# Altium schematic sheet Motor_Drivers.SchDoc
size A3; Author: İlker KESER; Revision: V1.0; SheetNumber: 4; SheetTotal: 9; Page: 4; Page Total: 9; Template: A3; Project Code: 02050838
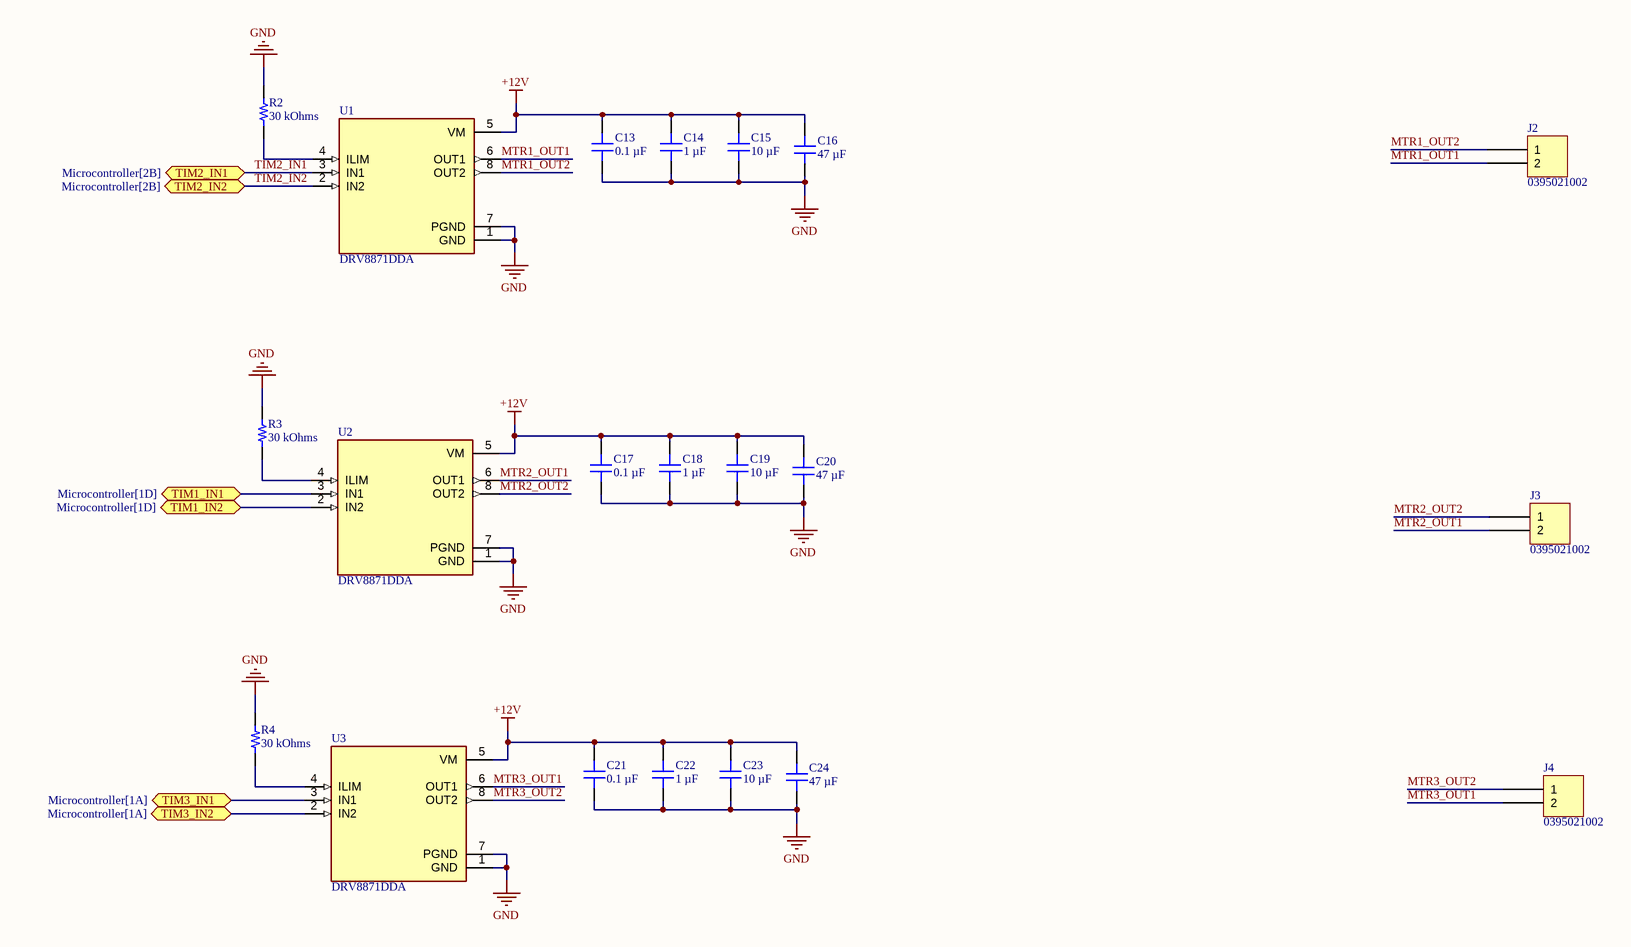
[diagram p0: Motor_Drivers.SchDoc]

## Parts
C13  0.1 µF  [CAP 0603_1608]
C14  1 µF  [MURATA GCM188 0603_1608]
C15  10 µF  [CAP 0603_1608]
C16  47 µF  [MURATA CAP GRM31C 1206_3216]
C17  0.1 µF  [CAP 0603_1608]
C18  1 µF  [MURATA GCM188 0603_1608]
C19  10 µF  [CAP 0603_1608]
C20  47 µF  [MURATA CAP GRM31C 1206_3216]
C21  0.1 µF  [CAP 0603_1608]
C22  1 µF  [MURATA GCM188 0603_1608]
C23  10 µF  [CAP 0603_1608]
C24  47 µF  [MURATA CAP GRM31C 1206_3216]
J2  0395021002  [MOLEX 395021002]
J3  0395021002  [MOLEX 395021002]
J4  0395021002  [MOLEX 395021002]
R2  30 kOhms  [YAGEO RES 0402_1005]
R3  30 kOhms  [YAGEO RES 0402_1005]
R4  30 kOhms  [YAGEO RES 0402_1005]
U1  DRV8871DDA  [DRV8871DDA]
U2  DRV8871DDA  [DRV8871DDA]
U3  DRV8871DDA  [DRV8871DDA]

## Ports
TIM1_IN1 (bidir, see Microcontroller[1D]), TIM1_IN2 (bidir, see Microcontroller[1D]), TIM2_IN1 (bidir, see Microcontroller[2B]), TIM2_IN2 (bidir, see Microcontroller[2B]), TIM3_IN1 (bidir, see Microcontroller[1A]), TIM3_IN2 (bidir, see Microcontroller[1A])

## Nets
+12V: C13.2 C14.2 C15.2 C16.2 C17.2 C18.2 C19.2 C20.2 C21.2 C22.2 C23.2 C24.2 U1.5(VM) U2.5(VM) U3.5(VM)
GND: C13.1 C14.1 C15.1 C16.1 C17.1 C18.1 C19.1 C20.1 C21.1 C22.1 C23.1 C24.1 R2.2 R3.2 R4.2 U1.1(GND) U1.7(PGND) U2.1(GND) U2.7(PGND) U3.1(GND) U3.7(PGND)
MTR1_OUT1: J2.2 U1.6(OUT1)
MTR1_OUT2: J2.1 U1.8(OUT2)
MTR2_OUT1: J3.2 U2.6(OUT1)
MTR2_OUT2: J3.1 U2.8(OUT2)
MTR3_OUT1: J4.2 U3.6(OUT1)
MTR3_OUT2: J4.1 U3.8(OUT2)
TIM1_IN1: U2.3(IN1) ; port TIM1_IN1
TIM1_IN2: U2.2(IN2) ; port TIM1_IN2
TIM2_IN1: U1.3(IN1) ; port TIM2_IN1
TIM2_IN2: U1.2(IN2) ; port TIM2_IN2
TIM3_IN1: U3.3(IN1) ; port TIM3_IN1
TIM3_IN2: U3.2(IN2) ; port TIM3_IN2
NetR2_1: R2.1 U1.4(ILIM)
NetR3_1: R3.1 U2.4(ILIM)
NetR4_1: R4.1 U3.4(ILIM)

## Notes on the sheet
- TITLE:
- DOCUMENT NAME:
- PROJECT CODE:
- TEMPLATE:
- REVISION:
- Sheet:
- of
- AUTHOR:

## Library data of the parts
C13 C17 C21 = C0603X104M3RAC7867: CAP CER 0.1UF 25V X7R 0603; manufacturer: KEMET; Tolerance: ±20%; Part Number: C0603X104M3RAC7867; Capacitance: 0.1 µF; Applications: Boardflex Sensitive; componentlink1description: Datasheet; componentlink1url: https://api.kemet.com/component-edge/download/datasheet/C0603X104M3RACTU.pdf; componentlink2description: DigiKey Link; componentlink2url: https://www.digikey.com/en/products/detail/kemet/C0603X104M3RAC7867/2202613; Device Package: 0603 (1608 Metric); Features: Soft Termination; lastupdated: 9.02.2024 20:10:30; Lifecycle Status: Active; Minimum Order: 1; Mounting Type: Surface Mount, MLCC; Operating Temperature: -55°C ~ 125°C; Package / Case: 0603 (1608 Metric); packaging: TapeAndReel; partid: 2484; Part Status: Active; price: 0.06; series: SMD Comm X7R Flex; Size / Dimension: 0.063" L x 0.031" W (1.60mm x 0.80mm); Supplier 1: DigiKey; Supplier Part Number 1: 399-13148-1-ND; Temperature Coefficient: X7R; Thickness (Max): 0.034" (0.87mm); value: 0.1 µF; Voltage - Rated: 25V
C14 C18 C22 = GCM188R71C105KA64J: CAP CER 1UF 16V X7R 0603; manufacturer: Murata Electronics; Tolerance: ±10%; Part Number: GCM188R71C105KA64J; Capacitance: 1 µF; Applications: Automotive; componentlink1description: Datasheet; componentlink1url: https://www.murata.com/~/media/webrenewal/support/library/catalog/products/capacitor/mlcc/c03e.ashx?la=en-us; componentlink2description: DigiKey Link; componentlink2url: https://www.digikey.com/en/products/detail/murata-electronics/GCM188R71C105KA64J/4903955; Device Package: 0603 (1608 Metric); lastupdated: 20.07.2024 00:25:01; Lifecycle Status: Active; Minimum Order: 1; Mounting Type: Surface Mount, MLCC; Operating Temperature: -55°C ~ 125°C; Package / Case: 0603 (1608 Metric); packaging: TapeAndReel; partid: 13992; Part Status: Active; price: 0.02; Ratings: AEC-Q200; series: GCM; Size / Dimension: 0.063" L x 0.031" W (1.60mm x 0.80mm); Supplier 1: DigiKey; Supplier Part Number 1: 490-12657-1-ND; Temperature Coefficient: X7R; Thickness (Max): 0.035" (0.90mm); value: 1 µF; Voltage - Rated: 16V
C15 C19 C23 = CC0603MRX5R7BB106: CAP CER 10UF 16V X5R 0603; manufacturer: Yageo; Tolerance: ±20%; Part Number: CC0603MRX5R7BB106; Capacitance: 10 µF; Applications: General Purpose; componentlink1description: Datasheet; componentlink1url: https://www.yageo.com/upload/media/product/productsearch/datasheet/mlcc/UPY-GPHC_X5R_4V-to-50V_26.pdf; componentlink2description: DigiKey Link; componentlink2url: https://www.digikey.com/en/products/detail/yageo/CC0603MRX5R7BB106/5195229; Device Package: 0603 (1608 Metric); lastupdated: 9.02.2024 20:09:51; Lifecycle Status: Active; Minimum Order: 1; Mounting Type: Surface Mount, MLCC; Operating Temperature: -55°C ~ 85°C; Package / Case: 0603 (1608 Metric); packaging: TapeAndReel; partid: 41163; Part Status: Active; price: 0.08; series: CC; Size / Dimension: 0.063" L x 0.031" W (1.60mm x 0.80mm); Supplier 1: DigiKey; Supplier Part Number 1: 311-1822-1-ND; Temperature Coefficient: X5R; Thickness (Max): 0.035" (0.90mm); value: 10 µF; Voltage - Rated: 16V
C16 C20 C24 = GRM31CR61E476ME44L: CAP CER 47UF 25V X5R 1206; manufacturer: Murata Electronics; Tolerance: ±20%; Part Number: GRM31CR61E476ME44L; Capacitance: 47 µF; Applications: General Purpose; componentlink2description: DigiKey Link; componentlink2url: https://www.digikey.com/en/products/detail/murata-electronics/GRM31CR61E476ME44L/7243446; Device Package: 1206 (3216 Metric); lastupdated: 6.09.2024 02:27:23; Lifecycle Status: Active; Minimum Order: 1; Mounting Type: Surface Mount, MLCC; Operating Temperature: -55°C ~ 85°C; Package / Case: 1206 (3216 Metric); packaging: CutTape; partid: 54228; Part Status: Active; price: 0.39; series: GRM; Size / Dimension: 0.126" L x 0.063" W (3.20mm x 1.60mm); Supplier 1: DigiKey; Supplier Part Number 1: 490-16268-2-ND; Temperature Coefficient: X5R; Thickness (Max): 0.071" (1.80mm); value: 47 µF; Voltage - Rated: 25V
J2-J4 = 0395021002: TERM BLOCK HDR 2POS 90DEG 3.5MM; Manufacturer: Molex; Current - UL: 8A; Header Orientation: 90°, Right Angle; Number of Levels: 1; Number of Positions: 2; Pitch: 0.138" (3.50mm); Voltage - UL: 300V; Part Number: 0395021002; Color: Black; ComponentLink1Description: Datasheet; ComponentLink1URL: https://www.molex.com/pdm_docs/sd/395021002_sd.pdf; ComponentLink2Description: DigiKey Link; ComponentLink2URL: http://digikey.com/product-detail/en/molex/0395021002/WM7770-ND/1280621; Contact Mating Finish: Tin; LastUpdated: 25.06.2020 15:44:05; Lifecycle Status: Active; Minimum Order: 1; Mounting Type: Through Hole; Operating Temperature: -40°C ~ 105°C; Packaging: Tray; Part Status: Active; Positions Per Level: 2; Price: 0.58; Series: Eurostyle ESE 39502; Supplier 1: DigiKey; Supplier Part Number 1: WM7770-ND; Termination Style: Solder; Type: Header, Male Pins, Shrouded (4 Side)
R2-R4 = RC0402FR-1330KL: RES 30K OHM 1% 1/16W 0402; Manufacturer: Yageo; Power (Watts): 0.063W, 1/16W; Temperature Coefficient: ±100ppm/°C; Part Number: RC0402FR-1330KL; Value: 30 kOhms; ComponentLink1Description: Datasheet; ComponentLink1URL: https://www.yageo.com/upload/media/product/productsearch/datasheet/rchip/PYu-RC_Group_51_RoHS_L_12.pdf; ComponentLink2Description: DigiKey Link; ComponentLink2URL: https://www.digikey.com/en/products/detail/yageo/RC0402FR-1330KL/16982146; Composition: Thick Film; Device Package: 0402 (1005 Metric); Features: Moisture Resistant; Height - Seated (Max): 0.016" (0.40mm); LastUpdated: 25.07.2024 09:17:59; Lifecycle Status: Active; Minimum Order: 1; Number of Terminations: 2; Operating Temperature: -55°C ~ 155°C; Package / Case: 0402 (1005 Metric); Packaging: CutTape; PartId: 76462; Part Status: Active; Price: 0.01; Resistance: 30 kOhms; Series: RC_L; Size / Dimension: 0.039" L x 0.020" W (1.00mm x 0.50mm); Supplier 1: DigiKey; Supplier Part Number 1: 13-RC0402FR-1330KLCT-ND; Supplier Device Package: 0402; Tolerance: ±1%
U1-U3 = DRV8871DDA: Unipolar Motor Driver NMOS PWM 8-SO PowerPad; Manufacturer: Texas Instrument; Motor Type - AC, DC: Brushed DC; Function: Driver - Fully Integrated, Control and Power Stage; Output Configuration: Full Bridge; Current - Output: 3.6A; Voltage - Supply: 6.5V ~ 45V; Motor Type - Stepper: Unipolar; Technology: NMOS; Interface: PWM; Applications: DC Motors, General Purpose, Stepper Motors; Voltage - Load: 6.5V ~ 45V; Operating Temperature: -40°C ~ 150°C (TJ); Mounting Type: Surface Mount; Package / Case: 8-PowerSOIC (0.154", 3.90mm Width); ComponentLink1Description: Datasheet; ComponentLink1URL: https://www.ti.com/lit/ds/symlink/drv8871.pdf?HQS=dis-dk-null-digikeymode-dsf-pf-null-wwe&ts=1746168243606&ref_url=https%253A%252F%252Fwww.ti.com%252Fgeneral%252Fdocs%252Fsuppproductinfo.tsp%253FdistId%253D10%2526gotoUrl%253Dhttps%253A%252F%252Fwww.ti.com%252Flit%252Fgpn%252Fdrv8871; ComponentLink2Description: Digikey Link; ComponentLink2URL: https://www.digikey.com/en/products/detail/texas-instruments/drv8871dda/6110574